# EAGLE design FeatherRemoteReceiverFullSMD (EAGLE 9.3.2)
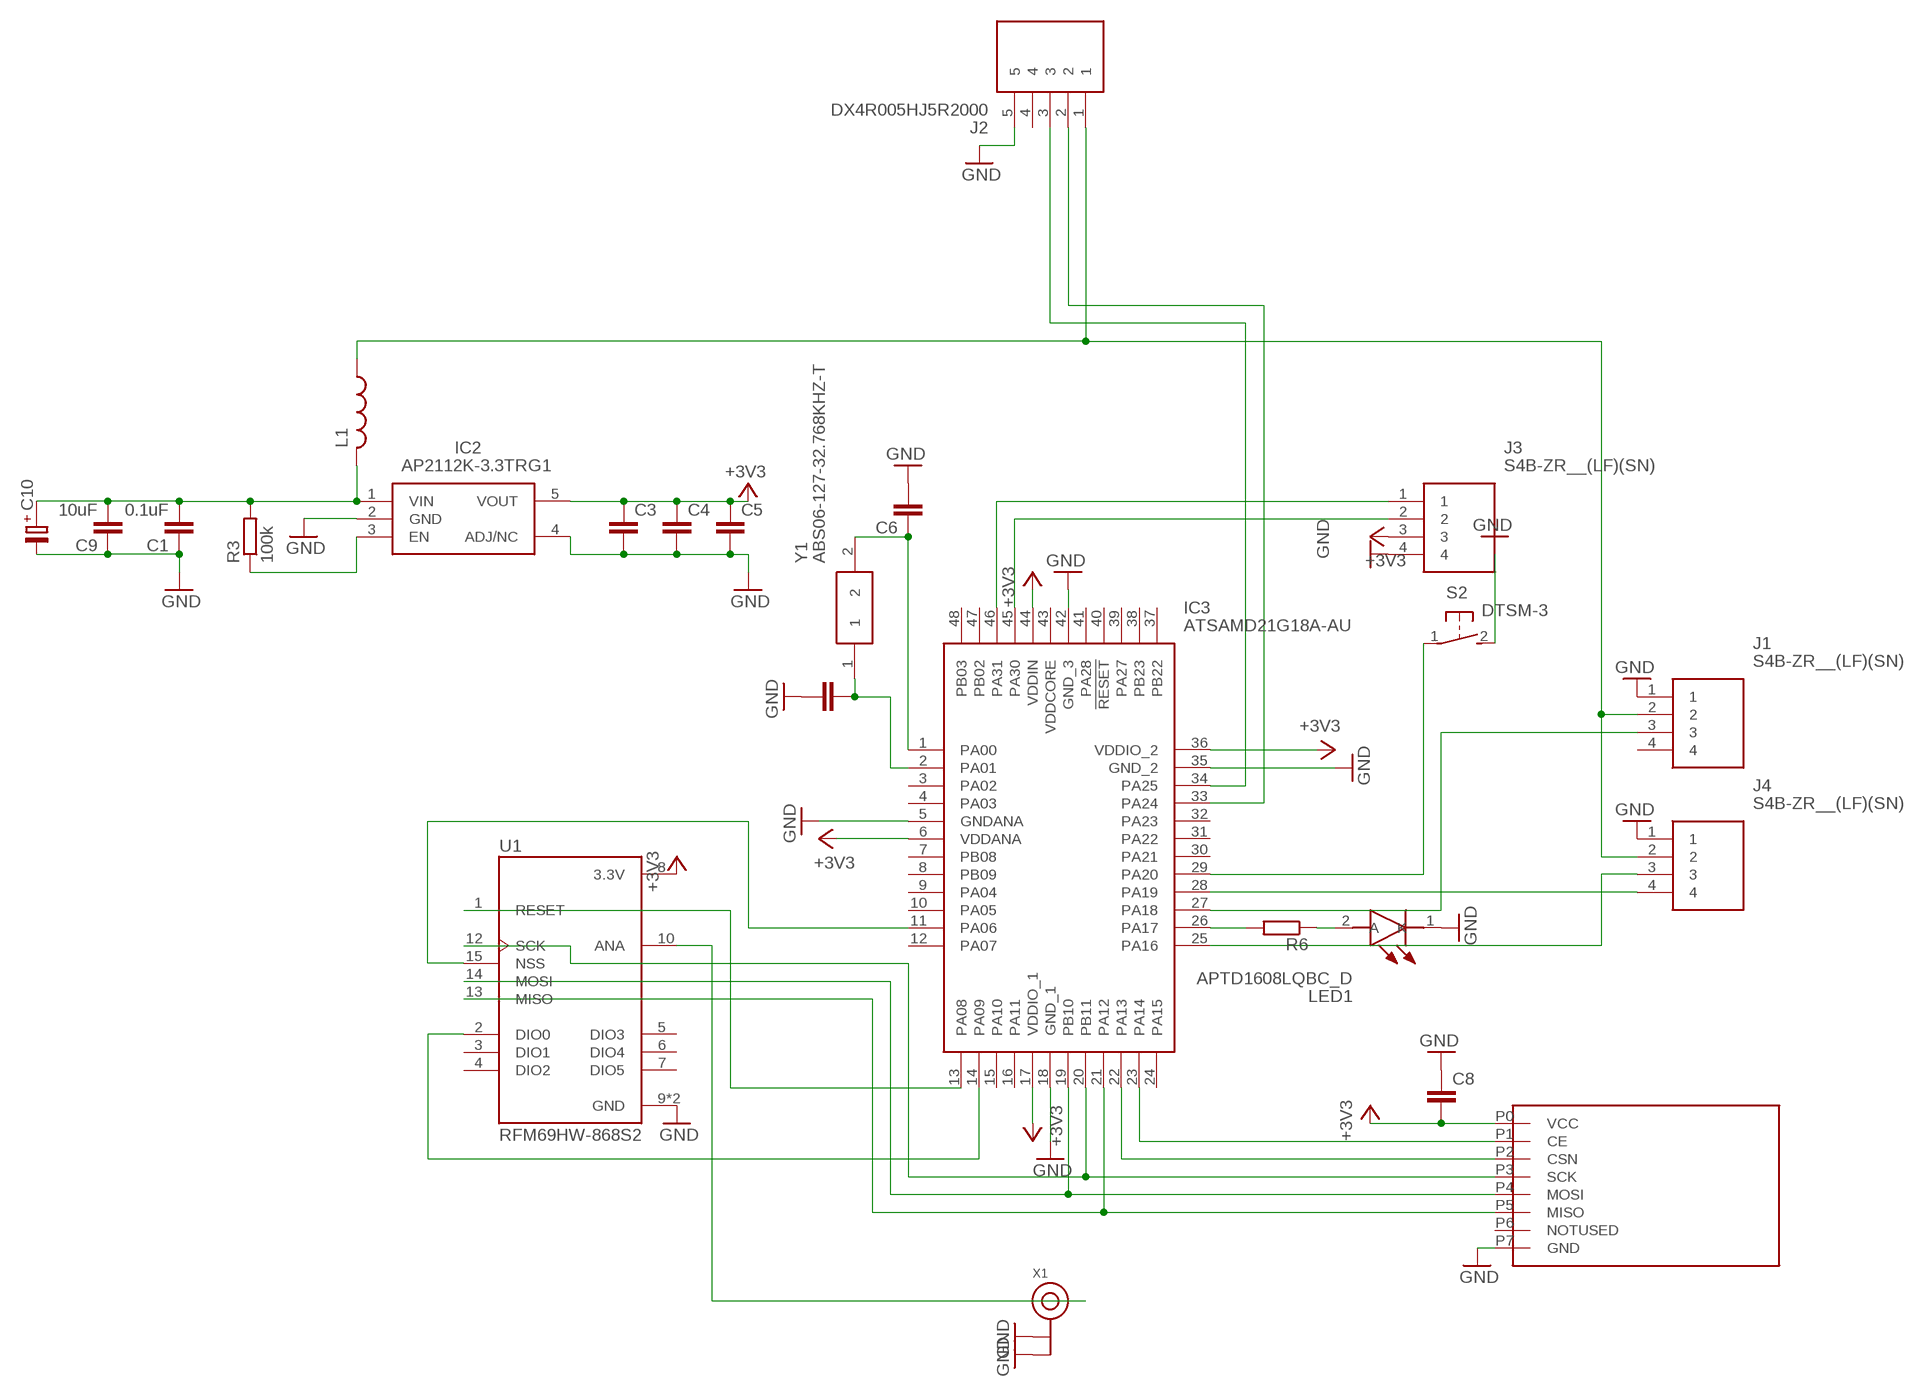
[diagram p0: schematic, sheet 1]

## Parts
C1  0.1uF  C-EUC0603  [C0603]
C3  C-EUC0603  [C0603]
C4  C-EUC0603  [C0603]
C5  C-EUC0603  [C0603]
C6  C-EUC0603  [C0603]
C7  C-EUC0603  [C0603]
C8  C-EUC0603  [C0603]
C9  10uF  C-EUC0603  [C0603]
C10  C-PR-SMD-TE-D  [TE-D-7343]
IC2  AP2112K-3.3TRG1  [SOT95P282X130-5N]
IC3  ATSAMD21G18A-AU  [QFP50P900X900X120-48N]
J1  S4B-ZR__(LF)(SN)  [SHDR4W50P0X150_1X4_750X600X370]
J2  DX4R005HJ5R2000  [DX4R005HJ5]
J3  S4B-ZR__(LF)(SN)  [SHDR4W50P0X150_1X4_750X600X370]
J4  S4B-ZR__(LF)(SN)  [SHDR4W50P0X150_1X4_750X600X370]
L1  L-USL1812  [L1812]
LED1  APTD1608LQBC_D  [LEDC1608X95N]
R3  100k  R-EU_R0603  [R0603]
R6  R-EU_R0603  [R0603]
S2  DTSM-3  [DTSM-3]
U1  RFM69HW-868S2  [XCVR_RFM69HW-868S2]
U$2  NRF24L01PA  [NRF24L01PA]
X1  ANTENNA_U.FL  [U.FL]
Y1  ABS06-127-32.768KHZ-T  [ABS0612732768KHZT]

## Nets
+3V3: C3.1 C4.1 C5.1 C8.2 IC2.5(VOUT) IC3.6(VDDANA) IC3.17(VDDIO_1) IC3.36(VDDIO_2) IC3.44(VDDIN) J3.3 U1.8(3.3V) U$2.P0(VCC)
GND: C1.1 C3.2 C4.2 C5.2 C6.2 C7.1 C8.1 C9.1 C10.- IC2.2(GND) IC2.4(ADJ/NC) IC3.5(GNDANA) IC3.18(GND_1) IC3.35(GND_2) IC3.42(GND_3) J1.1 J2.5 J3.4 J4.1 LED1.1(K) S2.2 U1.9(GND) U1.11(GND) U$2.P7(GND) X1.1(GND) X1.2(GND)
N$1: IC3.27(PA18) J1.3
N$2: IC3.29(PA20) S2.1
N$3: IC3.11(PA06) U1.15(NSS)
N$4: IC3.13(PA08) U1.1(RESET)
N$5: J1.2 J2.1 J4.2 L1.1
N$6: IC2.3(EN) R3.1
N$7: IC3.14(PA09) U1.2(DIO0)
N$8: IC3.33(PA24) J2.2
N$9: IC3.34(PA25) J2.3
N$10: C6.1 IC3.1(PA00) Y1.2
N$11: C7.2 IC3.2(PA01) Y1.1
N$12: IC3.26(PA17) R6.2
N$13: C1.2 C9.2 C10.+ IC2.1(VIN) L1.2 R3.2
N$14: IC3.46(PA31) J3.1
N$15: LED1.2(A) R6.1
N$16: IC3.19(PB10) U1.14(MOSI) U$2.P4(MOSI)
N$17: IC3.21(PA12) U1.13(MISO) U$2.P5(MISO)
N$18: IC3.20(PB11) U1.12(SCK) U$2.P3(SCK)
N$19: IC3.22(PA13) U$2.P2(CSN)
N$20: IC3.23(PA14) U$2.P1(CE)
N$21: IC3.45(PA30) J3.2
N$22: U1.10(ANA) X1.3(SIGNAL)
N$23: IC3.25(PA16) J4.3
N$24: IC3.28(PA19) J4.4
Unconnected: IC3.3(PA02) IC3.4(PA03) IC3.7(PB08) IC3.8(PB09) IC3.9(PA04) IC3.10(PA05) IC3.12(PA07) IC3.15(PA10) IC3.16(PA11) IC3.24(PA15) IC3.30(PA21) IC3.31(PA22) IC3.32(PA23) IC3.37(PB22) IC3.38(PB23) IC3.39(PA27) IC3.40(!RESET) IC3.41(PA28) IC3.43(VDDCORE) IC3.47(PB02) IC3.48(PB03) J1.4 J2.4 U1.3(DIO1) U1.4(DIO2) U1.5(DIO3) U1.6(DIO4) U1.7(DIO5) U$2.P6(NOTUSED)

## Library data of the parts
C1 C3-C9 = rcl:C-EU: CAPACITOR, European symbol; SPICEPREFIX: C
C10 = cap-pan40:C-PR: POLARIZED ELECTROLYTIC/TANTALUM
IC2 = SamacSys_Parts:AP2112K-3.3TRG1: 600mA 3.3V LDO Regulator Enable SOT23-5 DiodesZetex AP2112K-3.3TRG1, LDO Voltage Regulator, 3.3 V +/-1.5%, 2.5 6 Vin, 5-Pin SOT-23 Source: Datasheet <https://componentsearchengine.com/Datasheets/1/AP2112K-3.3TRG1.pdf>; DESCRIPTION: 600mA 3.3V LDO Regulator Enable SOT23-5 DiodesZetex AP2112K-3.3TRG1, LDO Voltage Regulator, 3.3 V +/-1.5%, 2.5 6 Vin, 5-Pin SOT-23; HEIGHT: 1.3mm; MANUFACTURER_NAME: Diodes Inc.; MANUFACTURER_PART_NUMBER: AP2112K-3.3TRG1; MOUSER_PART_NUMBER: 621-AP2112K-3.3TRG1; MOUSER_PRICE-STOCK: https://www.mouser.com/Search/Refine.aspx?Keyword=621-AP2112K-3.3TRG1
IC3 = SamacSys_Parts:ATSAMD21G18A-AU: ATMEL - ATSAMD21G18A-AU - MCU, 32BIT, CORTEX-M0+, 48MHZ, TQFP-48 Source: Datasheet <https://componentsearchengine.com/Datasheets/1/ATSAMD21G18A-AU.pdf>; DESCRIPTION: ATMEL - ATSAMD21G18A-AU - MCU, 32BIT, CORTEX-M0+, 48MHZ, TQFP-48; HEIGHT: 1.2mm; MANUFACTURER_NAME: Microchip; MANUFACTURER_PART_NUMBER: ATSAMD21G18A-AU; MOUSER_PART_NUMBER: 556-ATSAMD21G18A-AU; MOUSER_PRICE-STOCK: https://www.mouser.com/Search/Refine.aspx?Keyword=556-ATSAMD21G18A-AU
J1 J3 J4 = SamacSys_Parts:S4B-ZR__(LF)(SN): ZH 1.5MM HEADER SIDE ENTRY 04WAY JST ZH Series, 1.5mm Pitch 4 Way 1 Row Side Entry PCB Header, Solder Termination, 1A Source: Datasheet <http://www.jst-mfg.com/product/pdf/eng/eZH.pdf>; DESCRIPTION: ZH 1.5MM HEADER SIDE ENTRY 04WAY JST ZH Series, 1.5mm Pitch 4 Way 1 Row Side Entry PCB Header, Solder Termination, 1A; HEIGHT: 3.7mm; MANUFACTURER_NAME: JST (JAPAN SOLDERLESS TERMINALS); MANUFACTURER_PART_NUMBER: S4B-ZR (LF)(SN)
J2 = SamacSys_Parts:DX4R005HJ5R2000: USB Connectors microUSB 2.0 TYPE B STDMNT RCPT NO TAPER Source: Datasheet <https://componentsearchengine.com/Datasheets/1/DX4R005HJ5R2000.pdf>; DESCRIPTION: USB Connectors microUSB 2.0 TYPE B STDMNT RCPT NO TAPER; HEIGHT: mm; MANUFACTURER_NAME: JAE Electronics; MANUFACTURER_PART_NUMBER: DX4R005HJ5R2000; MOUSER_PART_NUMBER: 656-DX4R005HJ5R2000; MOUSER_PRICE-STOCK: https://www.mouser.com/Search/Refine.aspx?Keyword=656-DX4R005HJ5R2000
L1 = rcl:L-US: INDUCTOR, American symbol; SPICEPREFIX: L
LED1 = SamacSys_Parts:APTD1608LQBC_D: Standard LEDs - SMD 0603 Dome Lens LED Blue- 465nm Source: Datasheet <https://componentsearchengine.com/Datasheets/1/APTD1608LQBC_D.pdf>; DESCRIPTION: Standard LEDs - SMD 0603 Dome Lens LED Blue- 465nm; HEIGHT: 0.95mm; MANUFACTURER_NAME: Kingbright; MANUFACTURER_PART_NUMBER: APTD1608LQBC/D; MOUSER_PART_NUMBER: 604-APTD1608LQBCD; MOUSER_PRICE-STOCK: https://www.mouser.com/Search/Refine.aspx?Keyword=604-APTD1608LQBCD
R3 R6 = rcl:R-EU_: RESISTOR, European symbol; SPICEPREFIX: R
S2 = switch-tact:DTSM-3
U1 = RFM69HW-868S2:RFM69HW-868S2: Module: RF; FM transceiver; FSK; 868MHz; SPI; 1.8÷3.6VDC; 20dBm; SMD; AVAILABILITY: Unavailable; DESCRIPTION: Module: RF; FM transceiver; FSK; 868MHz; SPI; 1.8÷3.6VDC; 20dBm; SMD; MF: RF; MP: RFM69HW-868S2; PACKAGE: SMD-16 Hope Microelectronics; PRICE: None
U$2 = NRF24L01PA:NRF24L01PA
X1 = adafruit:ANTENNA_U.FL: U.FL Antenna Connector
Y1 = SamacSys_Parts:ABS06-127-32.768KHZ-T: Abracon 32.768kHz Crystal +/-20ppm SMD 2-Pin 2 x 1.2 x 0.6mm Source: Datasheet <https://componentsearchengine.com/Datasheets/1/ABS06-127-32.768kHz-T.pdf>; DESCRIPTION: Abracon 32.768kHz Crystal +/-20ppm SMD 2-Pin 2 x 1.2 x 0.6mm; HEIGHT: 0.6mm; MANUFACTURER_NAME: ABRACON; MANUFACTURER_PART_NUMBER: ABS06-127-32.768KHZ-T; MOUSER_PART_NUMBER: 815-ABS0612732.768KT; MOUSER_PRICE-STOCK: https://www.mouser.com/Search/Refine.aspx?Keyword=815-ABS0612732.768KT

## Board
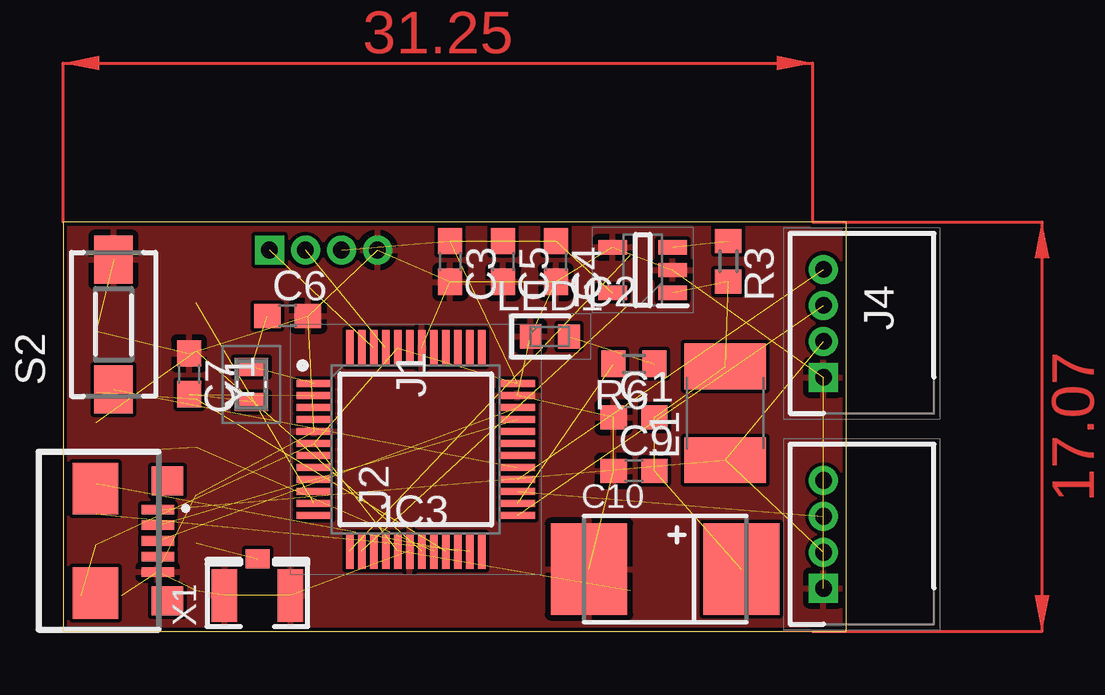
[diagram p1: board, top side]
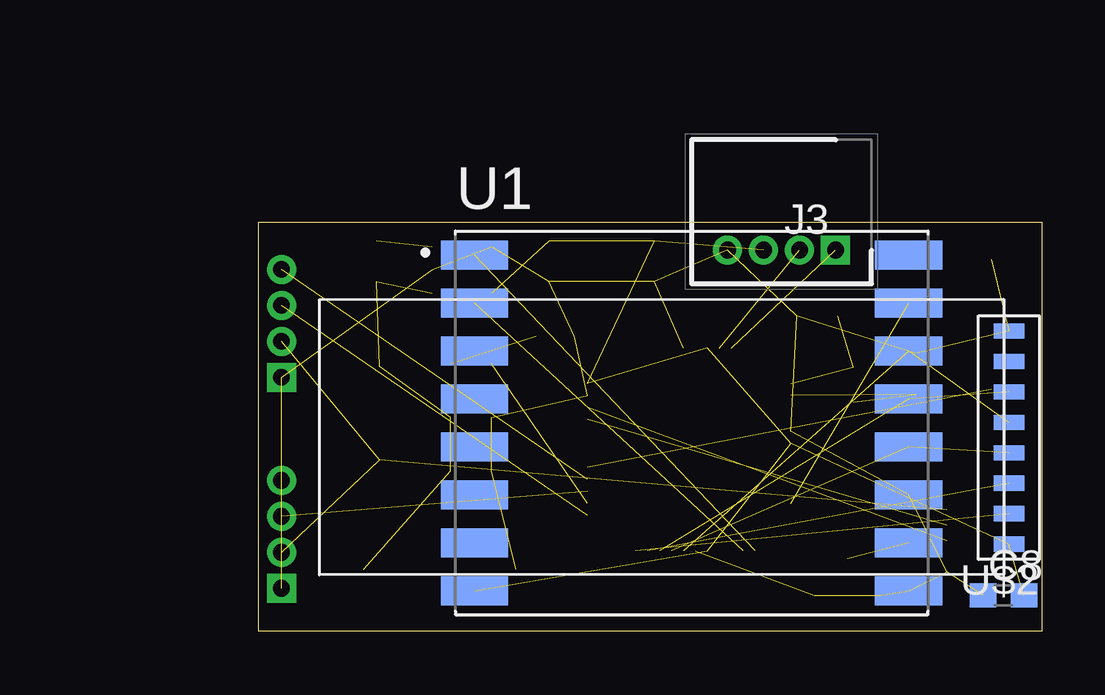
[diagram p2: board, bottom side, seen from below]

Size 32.65 x 17.07 mm. Coordinates in mm from the lower left corner, seen from the top.
Outline: 0,0 32.65,0 32.65,17.07 0,17.07 0,0
Copper layers (1*16): Top 0.035mm / dielectric 1.5mm / Bottom 0.035mm
Design rules "default": minimum track width 6mil, minimum drill 0.35mm, track to track 6mil, track to pad 6mil, pad to pad 6mil, via to via 6mil, smd to smd 6mil, copper to edge 6mil, drill to drill 6mil, minimum pad ring 10mil, minimum via ring 8mil, stop-mask expansion 4mil, vias tented up to drill 0mil, thermal gap 10mil

### Footprints (pad centres in the part's own frame; a part is rotated, then mirrored left to right if it is on the bottom)
C0603 = smd 1.1 x 1: 1 -0.85,0; 2 0.85,0
TE-D-7343 = smd 3.175 x 3.81: + 3.175,0; - -3.175,0
SOT95P282X130-5N = smd 1.2 x 0.6: 1 -1.25,0.95; 2 -1.25,0; 3 -1.25,-0.95; 4 1.25,-0.95; 5 1.25,0.95
QFP50P900X900X120-48N = smd 1.475 x 0.3: 1 -4.238,2.75; 2 -4.238,2.25; 3 -4.238,1.75; 4 -4.238,1.25; 5 -4.238,0.75; 6 -4.238,0.25; 7 -4.238,-0.25; 8 -4.238,-0.75; 9 -4.238,-1.25; 10 -4.238,-1.75; 11 -4.238,-2.25; 12 -4.238,-2.75; 25 4.238,-2.75; 26 4.238,-2.25; 27 4.238,-1.75; 28 4.238,-1.25; 29 4.238,-0.75; 30 4.238,-0.25; 31 4.238,0.25; 32 4.238,0.75; 33 4.238,1.25; 34 4.238,1.75; 35 4.238,2.25; 36 4.238,2.75 | smd 0.3 x 1.475: 13 -2.75,-4.238; 14 -2.25,-4.238; 15 -1.75,-4.238; 16 -1.25,-4.238; 17 -0.75,-4.238; 18 -0.25,-4.238; 19 0.25,-4.238; 20 0.75,-4.238; 21 1.25,-4.238; 22 1.75,-4.238; 23 2.25,-4.238; 24 2.75,-4.238; 37 2.75,4.238; 38 2.25,4.238; 39 1.75,4.238; 40 1.25,4.238; 41 0.75,4.238; 42 0.25,4.238; 43 -0.25,4.238; 44 -0.75,4.238; 45 -1.25,4.238; 46 -1.75,4.238; 47 -2.25,4.238; 48 -2.75,4.238
SHDR4W50P0X150_1X4_750X600X370 = drill 0.7 pad 1.1 square: 1 0,0 | drill 0.7 pad 1.1: 2 1.5,0; 3 3,0; 4 4.5,0
DX4R005HJ5 = smd 0.4 x 1.35: 1 2.41,-0.429; 2 3.06,-0.429; 3 3.71,-0.429; 4 4.36,-0.429; 5 5.01,-0.429 | smd 1.2 x 1.3: 6 6.21,-0.029; 7 1.21,-0.029 | smd 2.15 x 1.9: 8 1.535,-3.029; 9 5.885,-3.029
L1812 = smd 1.9 x 3.4: 1 -1.95,0; 2 1.95,0
LEDC1608X95N = smd 0.9 x 1: 1 -0.8,0; 2 0.8,0
R0603 = smd 1 x 1.1: 1 -0.85,0; 2 0.85,0
DTSM-3 = smd 2 x 1.6: 1 -2.7,0; 2 2.7,0
XCVR_RFM69HW-868S2 = smd 2.81 x 1.21: 1 -9.05,7; 2 -9.05,5; 3 -9.05,3; 4 -9.05,1; 5 -9.05,-1; 6 -9.05,-3; 7 -9.05,-5; 8 -9.05,-7; 9 9.05,-7; 10 9.05,-5; 11 9.05,-3; 12 9.05,-1; 13 9.05,1; 14 9.05,3; 15 9.05,5; 16 9.05,7
NRF24L01PA = smd 1.27 x 0.635: P0 -11.43,3.81; P1 -11.43,2.54; P2 -11.43,1.27; P3 -11.43,0; P4 -11.43,-1.27; P5 -11.43,-2.54; P6 -11.43,-3.81; P7 -11.43,-5.08
U.FL = smd 2.2 x 1.05: 1 0,1.375; 2 0,-1.375 | smd 0.8 x 1: 3 1.525,0
ABS0612732768KHZT = smd 0.75 x 1.4: 1 -0.725,0; 2 0.725,0

### Placement (x,y rotation side)
C1  23.8,8.93 0 top
C3  16.14,15.43 270 top
C4  20.54,15.43 270 top
C5  18.34,15.43 270 top
C6  9.36,13.16 0 top
C7  5.25,10.74 270 top
C8  1.6,1.5 0 bottom
C9  23.8,6.7 0 top
C10  25.1,2.6 0 top
IC2  24.16,15.07 180 top
IC3  14.7,7.59 0 top
J1  31.7,1.8 90 top
J2  4.38,7.49 270 top
J3  8.6,15.9 180 bottom
J4  31.7,10.6 90 top
L1  27.6,9.1 90 top
LED1  20.29,12.3 0 top
R3  27.73,15.43 270 top
R6  23.8,11.16 180 top
S2  2.1,12.8 90 top
U1  14.6,8.7 0 bottom
U$2  12.8,7.45 180 bottom
X1  8.1,1.5 90 top
Y1  7.85,10.3 90 top

### Tracks (layer width: path | path; a pad name or v marks a point on that pad's centre or on a via)
+3V3  (11 unrouted)
GND  (25 unrouted)
  pour Top: -2.5,20.2 36.7,20.2 36.9,20 36.9,-3.2 -3.5,-3.2 -3.5,19.2
N$1  (1 unrouted)
N$2  (1 unrouted)
N$3  (1 unrouted)
N$4  (1 unrouted)
N$5  (3 unrouted)
N$6  (1 unrouted)
N$7  (1 unrouted)
N$8  (1 unrouted)
N$9  (1 unrouted)
N$10  (2 unrouted)
N$11  (2 unrouted)
N$12  (1 unrouted)
N$13  (5 unrouted)
N$14  (1 unrouted)
N$15  (1 unrouted)
N$16  (2 unrouted)
N$17  (2 unrouted)
N$18  (2 unrouted)
N$19  (1 unrouted)
N$20  (1 unrouted)
N$21  (1 unrouted)
N$22  (1 unrouted)
N$23  (1 unrouted)
N$24  (1 unrouted)
(copper drawn outside any net)
  shapes: Top area x2